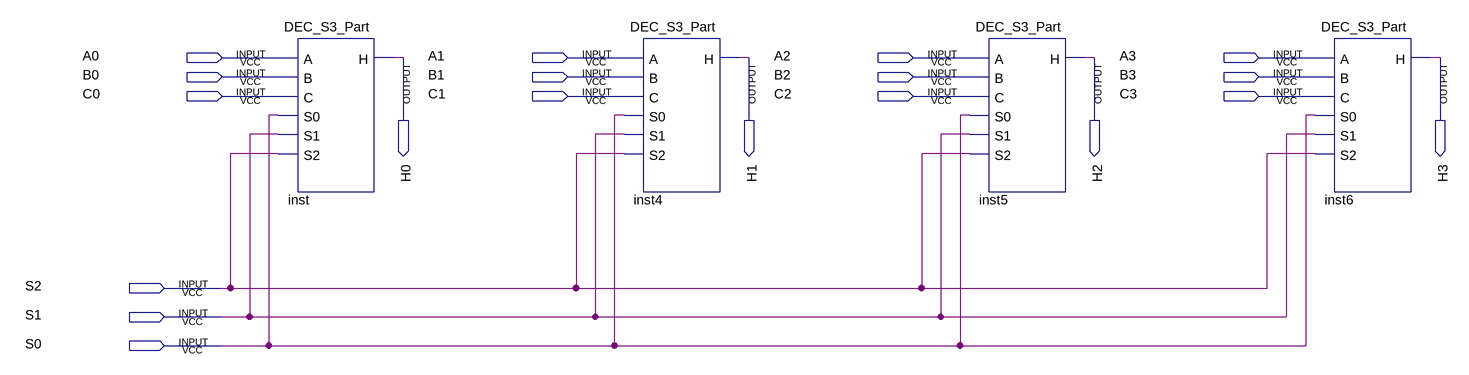
[diagram p0: schematic sheet]
// Quartus schematic DEC_S3.bdf as structural Verilog: 4 symbols, 19 pins
module DEC_S3 (
  input  A0,
  input  A1,
  input  A2,
  input  A3,
  input  B0,
  input  B1,
  input  B2,
  input  B3,
  input  C0,
  input  C1,
  input  C2,
  input  C3,
  input  S2,
  input  S1,
  input  S0,
  output H0,
  output H1,
  output H2,
  output H3
);

  DEC_S3_Part inst (.A(A0), .B(B0), .C(C0), .S0(S0), .S1(S1), .S2(S2), .H(H0));
  DEC_S3_Part inst4 (.A(A1), .B(B1), .C(C1), .S0(S0), .S1(S1), .S2(S2), .H(H1));
  DEC_S3_Part inst5 (.A(A2), .B(B2), .C(C2), .S0(S0), .S1(S1), .S2(S2), .H(H2));
  DEC_S3_Part inst6 (.A(A3), .B(B3), .C(C3), .S0(S0), .S1(S1), .S2(S2), .H(H3));
endmodule
